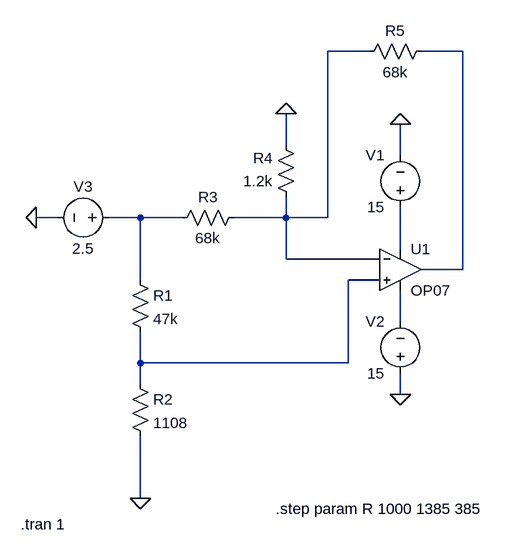
[diagram p0: schematic PT1000.asc]
PT1000.asc, the LTspice schematic file:
Version 4
SHEET 1 880 680
WIRE 352 -336 288 -336
WIRE 496 -336 432 -336
WIRE 224 -192 224 -240
WIRE 400 -176 400 -224
WIRE -128 -80 -160 -80
WIRE 0 -80 -48 -80
WIRE 64 -80 0 -80
WIRE 224 -80 224 -112
WIRE 224 -80 144 -80
WIRE 288 -80 288 -336
WIRE 288 -80 224 -80
WIRE 400 -32 400 -96
WIRE 224 -16 224 -80
WIRE 368 -16 224 -16
WIRE 496 0 496 -336
WIRE 496 0 432 0
WIRE 0 16 0 -80
WIRE 368 16 320 16
WIRE 400 80 400 32
WIRE 0 144 0 96
WIRE 320 144 320 16
WIRE 320 144 0 144
WIRE 0 176 0 144
WIRE 400 192 400 160
WIRE 0 352 0 256
FLAG 400 192 0
FLAG 400 -224 0
FLAG 0 352 0
FLAG -160 -80 0
FLAG 224 -240 0
DATAFLAG 0 144 ""
DATAFLAG 224 -80 ""
DATAFLAG 496 -16 ""
SYMBOL voltage 400 -80 R180
WINDOW 0 24 96 Left 2
WINDOW 3 24 16 Left 2
WINDOW 123 0 0 Left 0
WINDOW 39 0 0 Left 0
SYMATTR InstName V1
SYMATTR Value 15
SYMBOL voltage 400 176 R180
WINDOW 0 24 96 Left 2
WINDOW 3 24 16 Left 2
WINDOW 123 0 0 Left 0
WINDOW 39 0 0 Left 0
SYMATTR InstName V2
SYMATTR Value 15
SYMBOL OpAmps\\OP07 400 -64 R0
SYMATTR InstName U1
SYMBOL voltage -32 -80 R90
WINDOW 0 -32 56 VBottom 2
WINDOW 3 32 56 VTop 2
WINDOW 123 0 0 Left 0
WINDOW 39 0 0 Left 0
SYMATTR InstName V3
SYMATTR Value 2.5
SYMBOL res -16 0 R0
SYMATTR InstName R1
SYMATTR Value 47k
SYMBOL res -16 160 R0
SYMATTR InstName R2
SYMATTR Value 1108
SYMBOL res 160 -96 R90
WINDOW 0 0 56 VBottom 2
WINDOW 3 32 56 VTop 2
SYMATTR InstName R3
SYMATTR Value 68k
SYMBOL res 240 -96 R180
WINDOW 0 36 76 Left 2
WINDOW 3 36 40 Left 2
SYMATTR InstName R4
SYMATTR Value 1.2k
SYMBOL res 336 -320 R270
WINDOW 0 32 56 VTop 2
WINDOW 3 0 56 VBottom 2
SYMATTR InstName R5
SYMATTR Value 68k
TEXT 208 368 Left 2 !.step param R 1000 1385 385
TEXT -184 392 Left 2 !.tran 1

The netlist it stands for:
* PT1000.asc
V1 N004 0 15
V2 0 N006 15
XU1 N005 N001 N004 N006 N002 LT1001  ; OP07, pins In+ In- V+ V- OUT
V3 N003 0 2.5
R1 N003 N005 47k
R2 N005 0 1108
R3 N001 N003 68k
R4 N001 0 1.2k
R5 N001 N002 68k
.step param R 1000 1385 385
.tran 1
.lib LTC.lib
.backanno
.end